# EasyEDA schematic senseStack_SensorModule_schematic.json
TITLE: SenseStack - Sensor Module; REV: 1.0; Date: 2020-02-23; Sheet: 1/1; Drawn By: maxmaczaa; Company: SW Project3
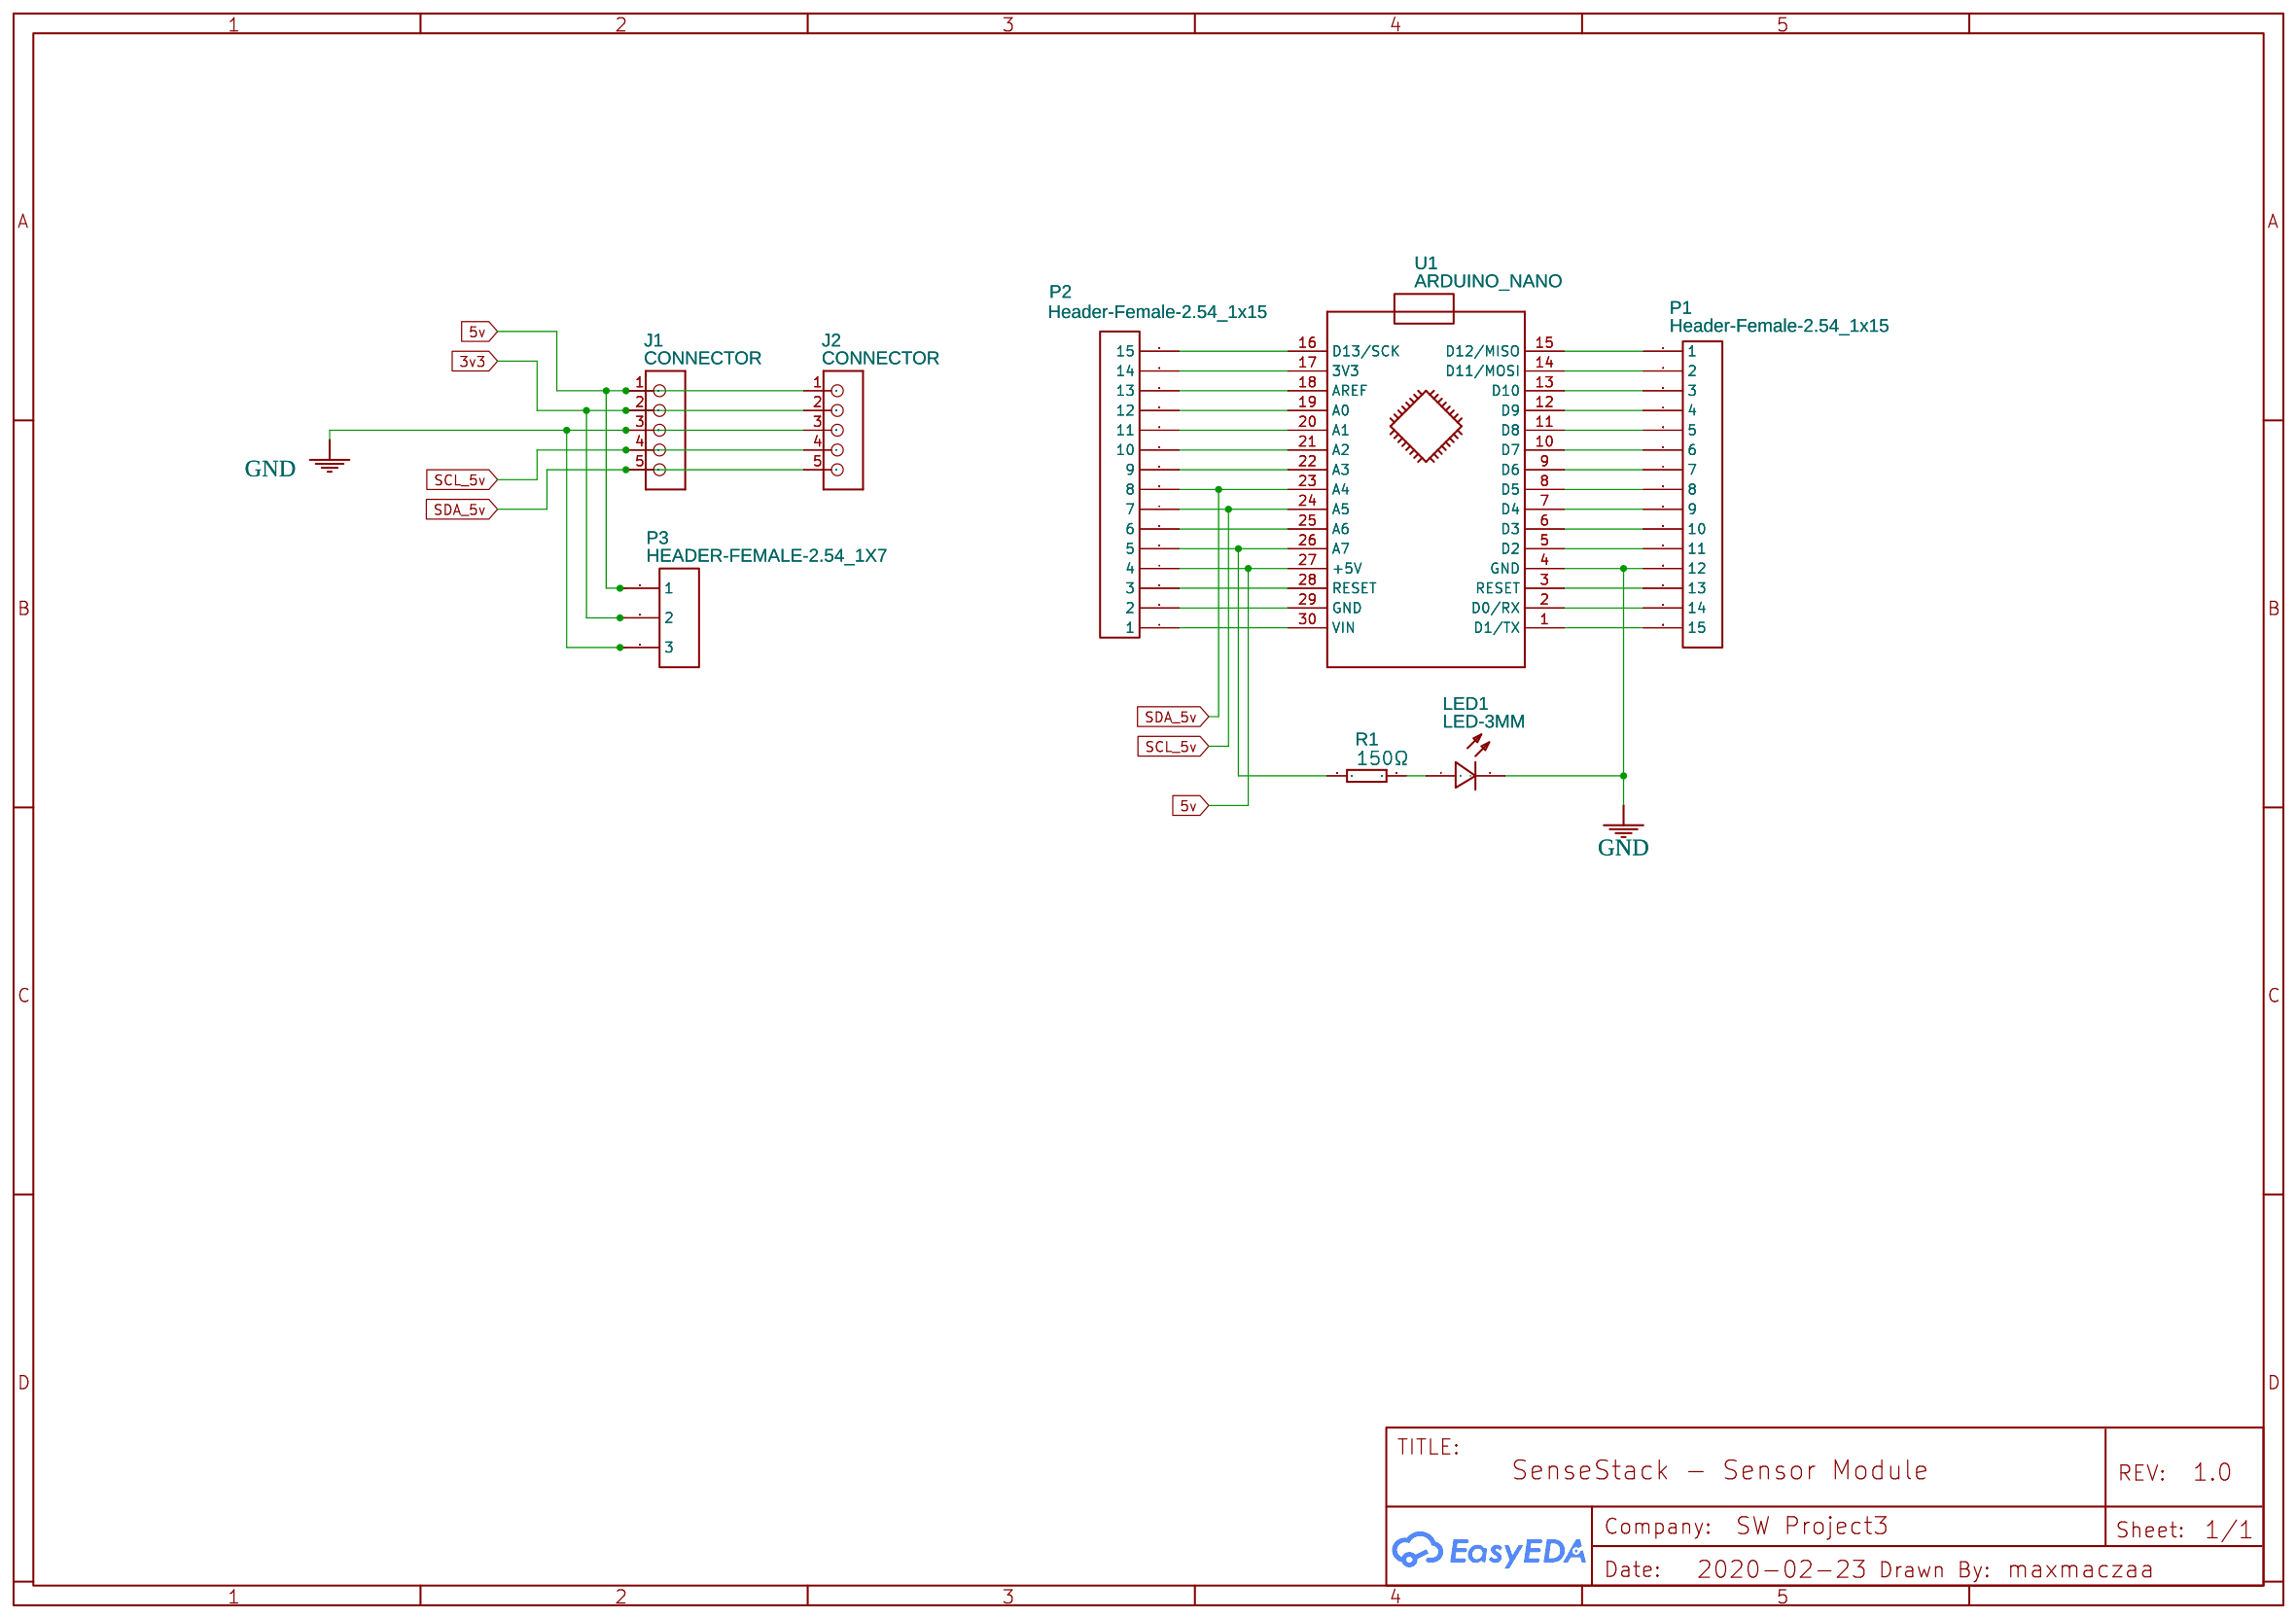
[diagram p0: schematic sheet]

## Parts
J1  CONNECTOR  [HDR1X5]
J2  CONNECTOR  [HDR1X5]
LED1  LED-3MM  [LED-3MM/2.54]
P1  Header-Female-2.54_1x15  [HDR-15X1/2.54]
P2  Header-Female-2.54_1x15  [HDR-15X1/2.54]
P3  HEADER-FEMALE-2.54_1X7  [HDR-3X1/2.54]
R1  150Ω  [RTH025W]
U1  ARDUINO_NANO  [ARDUINO_NANO]

## Library data of the parts
J1 J2 = CONNECTOR_HEADER-6P_CONNECTOR_6P-2.54-8040MIL
LED1 = LED-3MM: Supplier: LCSC; Manufacturer: EVERLIGHT; Manufacturer Part: 204-10SURD/S530-A3; Supplier Part: C99772
P1 P2 = Header-Female-2.54_1x15: Supplier Part: undefined; Supplier: LCSC; Manufacturer: LCSC; Contributor: maxmac zaa
P3 = HEADER-FEMALE-2.54_1X7: Supplier Part: undefined; Supplier: LCSC; Manufacturer: LCSC; Manufacturer Part: Header-Female-2.54_1x10
R1 = RESISTOR: Contributor: DangerousPrototype
U1 = ARDUINO_NANO: sourceId: KGSeAWhDB

## Nets
3v3: J1.2 J2.2 P3.2
5v: J1.1 J2.1 P2.4 P3.1 U1.27(+5V)
GND: J1.3 J2.3 LED1.2(-) P1.12 P3.3 U1.4(GND)
SCL_5v: J1.4 J2.4 P2.7 U1.24(A5)
SDA_5v: J1.5(4) J2.5(4) P2.8 U1.23(A4)
Net-(LED1-1): LED1.1(+) R1.2
Net-(P1-1): P1.1 U1.15(D12/MISO)
Net-(P1-2): P1.2 U1.14(D11/MOSI)
Net-(P1-3): P1.3 U1.13(D10)
Net-(P1-4): P1.4 U1.12(D9)
Net-(P1-5): P1.5 U1.11(D8)
Net-(P1-6): P1.6 U1.10(D7)
Net-(P1-7): P1.7 U1.9(D6)
Net-(P1-8): P1.8 U1.8(D5)
Net-(P1-9): P1.9 U1.7(D4)
Net-(P1-10): P1.10 U1.6(D3)
Net-(P1-11): P1.11 U1.5(D2)
Net-(P1-13): P1.13 U1.3(RESET)
Net-(P1-14): P1.14 U1.2(D0/RX)
Net-(P1-15): P1.15 U1.1(D1/TX)
Net-(P2-1): P2.1 U1.30(VIN)
Net-(P2-2): P2.2 U1.29(GND)
Net-(P2-3): P2.3 U1.28(RESET)
Net-(P2-5): P2.5 R1.1 U1.26(A7)
Net-(P2-6): P2.6 U1.25(A6)
Net-(P2-9): P2.9 U1.22(A3)
Net-(P2-10): P2.10 U1.21(A2)
Net-(P2-11): P2.11 U1.20(A1)
Net-(P2-12): P2.12 U1.19(A0)
Net-(P2-13): P2.13 U1.18(AREF)
Net-(P2-14): P2.14 U1.17(3V3)
Net-(P2-15): P2.15 U1.16(D13/SCK)
